# EasyEDA Pro project ProPrj_图书馆管理系统.epro

# Schematic Schematic1
Board Name: Board1; Create Date: 2025-07-24; Page Name: P1; Project Name: 图书馆管理系统; Schematic Name: Schematic1; Update Date: 2025-07-24; Company: 嘉立创EDA; Page Size: A4; Version: V1.0
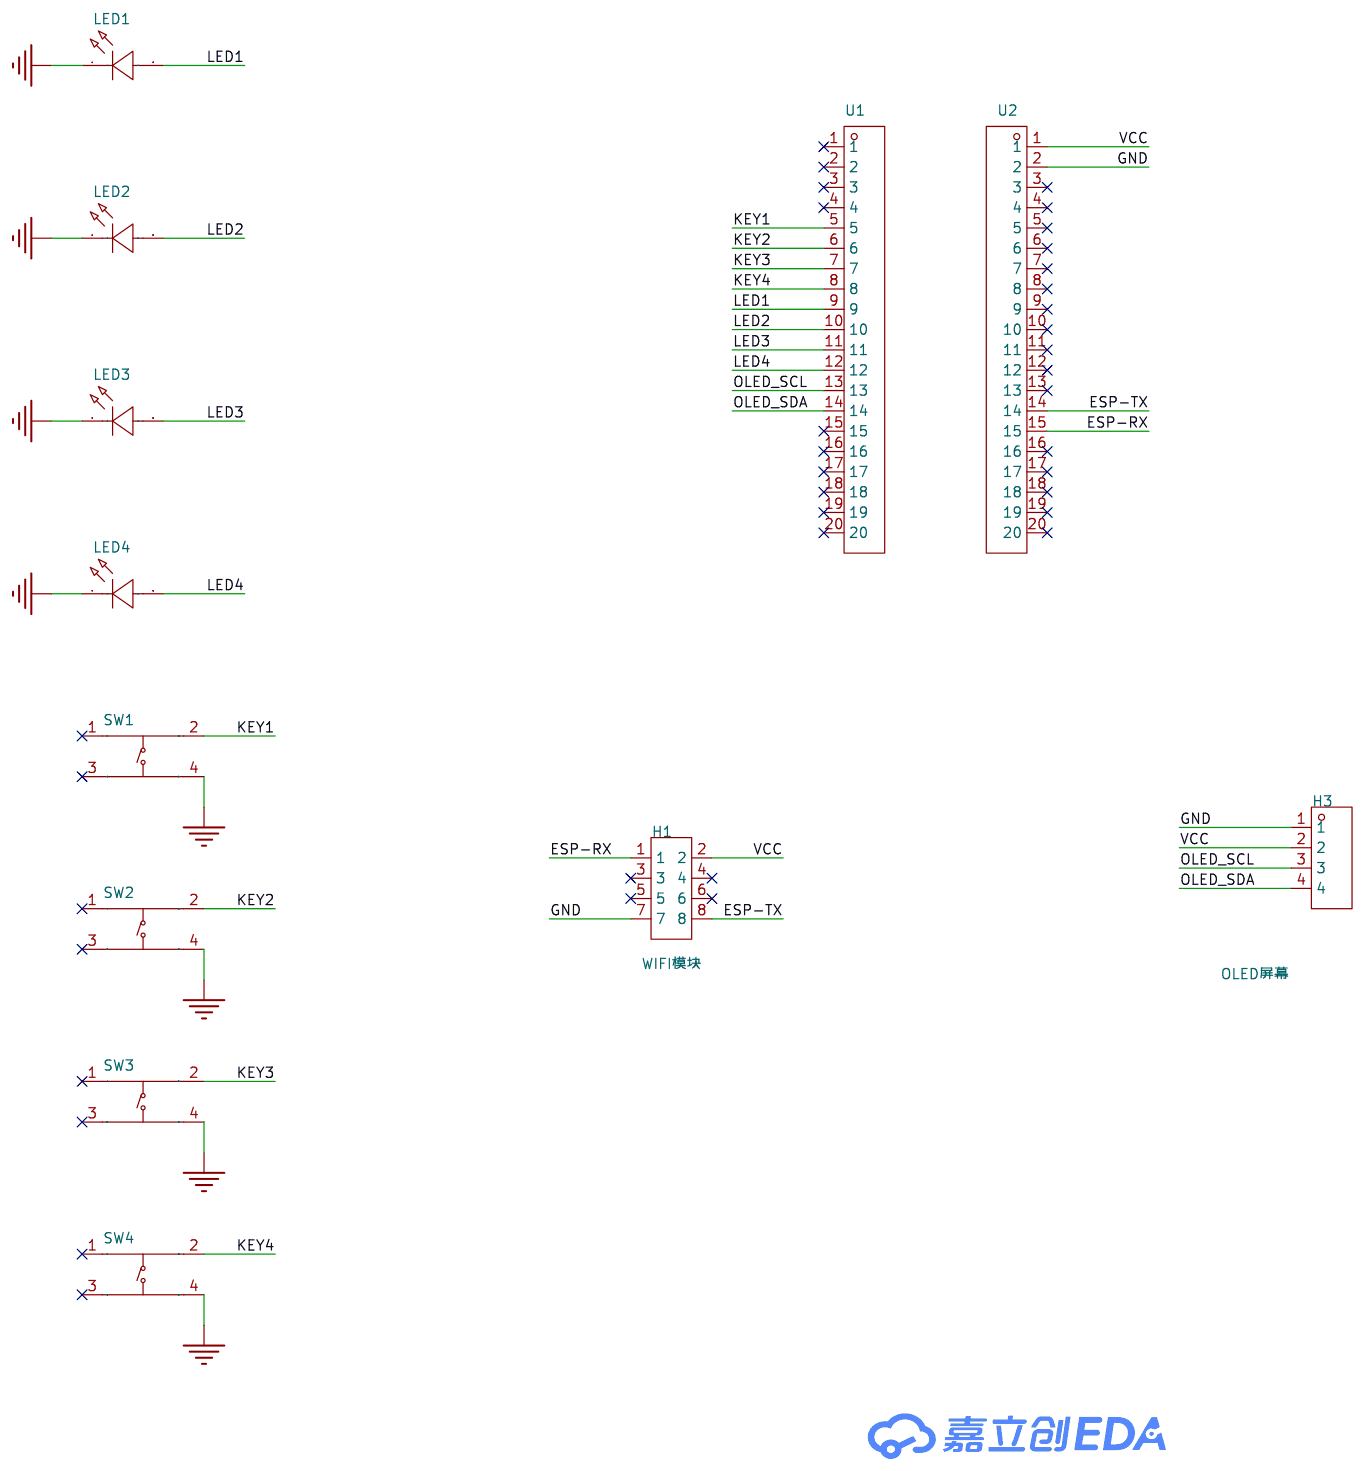
[diagram p0: schematic sheet]

## Parts
H1  WIFI模块  [HDR-TH_8P-P2.54-V-M-R2-C4-S2.54]
H3  OLED屏幕  [HDR-TH_4P-P2.54-V-M]
LED1  XL-302SURD  [LED-TH_BD3.8-P2.54-RD]
LED2  XL-302SURD  [LED-TH_BD3.8-P2.54-RD]
LED3  XL-302SURD  [LED-TH_BD3.8-P2.54-RD]
LED4  XL-302SURD  [LED-TH_BD3.8-P2.54-RD]
SW1  TS665CJ  [SW-TH_4P-L6.0-W6.0-P4.50-LS6.5]
SW2  TS665CJ  [SW-TH_4P-L6.0-W6.0-P4.50-LS6.5]
SW3  TS665CJ  [SW-TH_4P-L6.0-W6.0-P4.50-LS6.5]
SW4  TS665CJ  [SW-TH_4P-L6.0-W6.0-P4.50-LS6.5]
U1  ZX-PM2.54-1-20PY  [HDR-TH_20P-P2.54-V-F]
U2  ZX-PM2.54-1-20PY  [HDR-TH_20P-P2.54-V-F]

## Library data of the parts
H1 = PZ254V-12-8P: 插针结构:2x4P;间距:2.54mm;行距:2.54mm;圆针/方针:方针;安装方式:直插;排数:双排;总PIN位数:8P;额定电流:-;额定电压:-;配合针长度:6mm;塑高:2.5mm;端接针长度:3mm;触头材质:黄铜;触头镀层:-;工作温度:-40℃~+105℃;颜色:黑色;; LCSC Part Name: 2x4P 间距:2.54mm 方针 直插; Supplier Part: C492421; Manufacturer: XFCN(兴飞); Supplier Footprint: 插件,P=2.54mm; JLCPCB Part Class: 扩展库; Datasheet: https://atta.szlcsc.com/upload/public/pdf/source/20200309/C492421_DC8A206AF99CD7755BD4A5B0BC48200B.pdf; Supplier: LCSC; Pin Structure: 2x4P; Pitch: 2.54mm; Row Spacing: 2.54mm; Circluar Pins/Square Pins: 方针; Mounting Type: 直插; Number of Rows: 双排; Number of Pins: 8P; Length of Mating Pin: 6mm; Insulation Height: 2.5mm; Length of End Connection Pin: 3mm; Contact Material: 黄铜; Operating Temperature: -40℃~+105℃; Color: 黑色
H3 = PZ254V-11-04P: 插针结构:1x4P;间距:2.54mm;行距:-;圆针/方针:方针;安装类型:直插;排数:单排;总PIN位数:4P;额定电流:3A;额定电压:250V;配合针长度:6mm;塑高:2.5mm;端接针长度:3mm;触头材质:-;工作温度范围:-40℃~+105℃;颜色:黑色;; LCSC Part Name: 间距:2.54mm 1x4P 直插 方针; Supplier Part: C2691448; Manufacturer: XFCN(兴飞); Supplier Footprint: 插件,P=2.54mm; Datasheet: https://atta.szlcsc.com/upload/public/pdf/source/20200309/C492403_F9F19131791D08044AD4F84F8E751A34.pdf; Supplier: LCSC; Pin Structure: 1x4P; Pitch: 2.54mm; Circluar Pins/Square Pins: 方针; Mounting Type: 直插; Number of Rows: 单排; Number of Pins: 4P; Current Rating (Max): 3A; Voltage Rating (Max): 250V; Length of Mating Pin: 6mm; Insulation Height: 2.5mm; Length of End Connection Pin: 3mm; Operating Temperature Range: -40℃~+105℃; Color: 黑色
LED1-LED4 = XL-302SURD: 灯头类型:3mm圆形灯头;发光颜色:红色;功率:80mW;正向电流:30mA;主波长:615nm~620nm;透镜颜色:红色透镜;色温:-;发光角度:50°;载带方式:-;工作温度:-25℃~+85℃;; Supplier Part: C2895470; Manufacturer: XINGLIGHT(成兴光); Supplier Footprint: 插件,D=3mm; JLCPCB Part Class: 扩展库; Datasheet: https://atta.szlcsc.com/upload/public/pdf/source/20240112/E1E2B82945FD635E4907401DDE6D4922.pdf; Supplier: LCSC; Lamp Holder Type: 3mm圆形灯头; Emitted Color: 红色; Power Dissipation: 80mW; Forward Current: 30mA; Dominant Wavelength: 615nm~620nm; Peak Wavelength: 625nm; Lens Color: 红色透镜; Viewing Angle: 50°; Operating Temperature: -25℃~+85℃
SW1-SW4 = TS665CJ: 电路结构:单刀单掷;按钮形状:圆形按钮;安装方式:直插;开关长度:6mm;开关宽度:6mm;开关高度:5mm;触点电流:50mA;额定电压(DC):12V;带灯:-;机械寿命:-;; LCSC Part Name: 6*6*5mm 直插 轻触开关; Supplier Part: C393938; Manufacturer: SHOU HAN(首韩); Supplier Footprint: 插件; JLCPCB Part Class: 扩展库; Datasheet: https://atta.szlcsc.com/upload/public/pdf/source/20190521/C393938_BDABEAC600B4C55E200A80AA129B70BC.pdf; Supplier: LCSC; Circuit: 单刀单掷; Actuator Style: 圆形按钮; Mounting Style: 直插; Switch Length: 6mm; Switch Width: 6mm; Switch Height: 5mm; Contact Current: 50mA; Voltage Rating (DC): 12V
U1 U2 = ZX-PM2.54-1-20PY: 插孔结构:1x20P;间距:2.54mm;行距:-;圆孔/方孔:方孔;安装方式:直插;排数:单排;总孔位数:20P;额定电流:3A;额定电压:-;插孔方向:顶部;塑高:8.5mm;触头材质:-;触头镀层:金;工作温度:-40℃~+105℃;; LCSC Part Name: 1x20P 间距:2.54mm 直插; Supplier Part: C7499336; Manufacturer: Megastar(兆星); Supplier Footprint: 插件,P=2.54mm; JLCPCB Part Class: 扩展库; Datasheet: https://atta.szlcsc.com/upload/public/pdf/source/20231122/D07E8E83FD020EE141D56DDF9758AF41.pdf; Supplier: LCSC; Holes Structure: 1x20P; Pitch: 2.54mm; Circular Hole / Square Hole: 方孔; Mounting Type: 直插; Number of Rows: 单排; Number of Positions: 20P; Current Rating: 3A; Holes Direction: 顶部; Insulation Height: 8.5mm; Contact Plating: 金; Operating Temperature: -40℃~+105℃; PIN Length: 3.2mm

## Nets
GND: H1.7 H3.1 LED1.1(K) LED2.1(K) LED3.1(K) LED4.1(K) SW1.4(D) SW2.4(D) SW3.4(D) SW4.4(D) U2.2
VCC: H1.2 H3.2 U2.1
ESP-RX: H1.1 U2.15
ESP-TX: H1.8 U2.14
KEY1: SW1.2(B) U1.5
KEY2: SW2.2(B) U1.6
KEY3: SW3.2(B) U1.7
KEY4: SW4.2(B) U1.8
LED1: LED1.2(A) U1.9
LED2: LED2.2(A) U1.10
LED3: LED3.2(A) U1.11
LED4: LED4.2(A) U1.12
OLED_SCL: H3.3 U1.13
OLED_SDA: H3.4 U1.14

Not connected (* = marked no-connect by the designer): H1 3* 4* 5* 6*; SW1 1(A)* 3(C)*; SW2 1(A)* 3(C)*; SW3 1(A)* 3(C)*; SW4 1(A)* 3(C)*; U1 1* 2* 3* 4* 15* 16* 17* 18* 19* 20*; U2 3* 4* 5* 6* 7* 8* 9* 10* 11* 12* 13* 16* 17* 18* 19* 20*

# Board PCB1
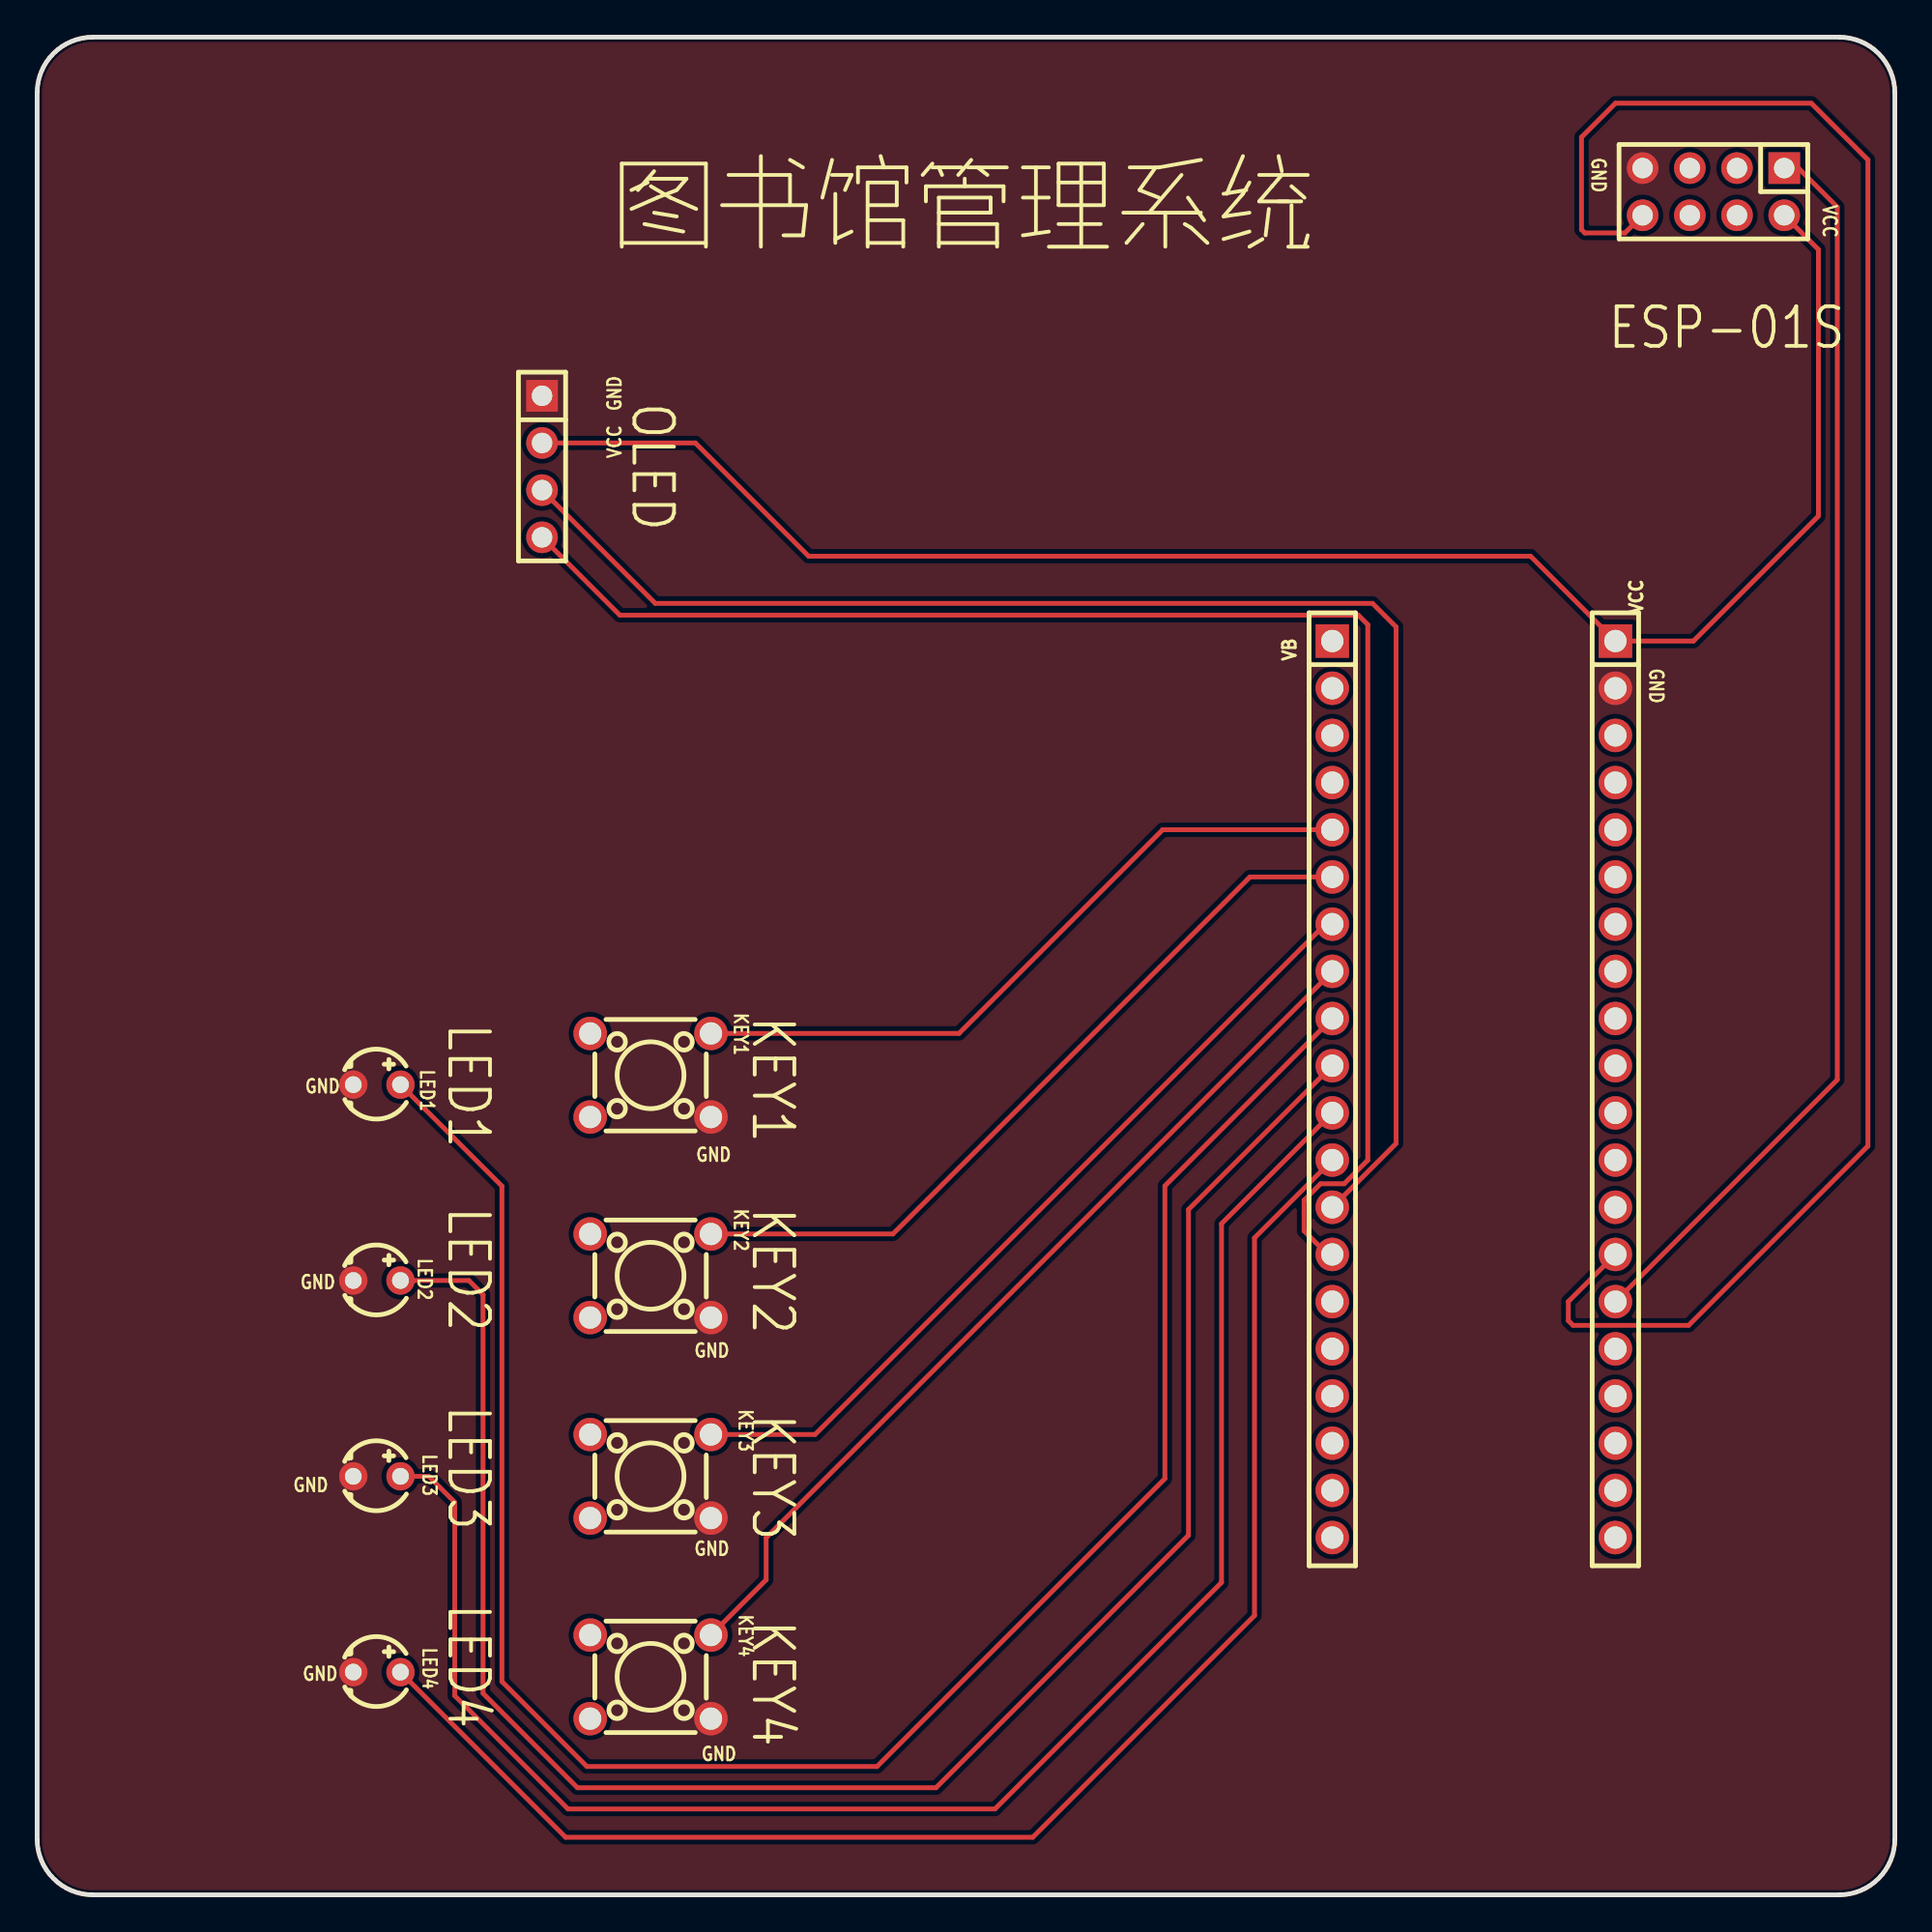
[diagram p1: board, top side]
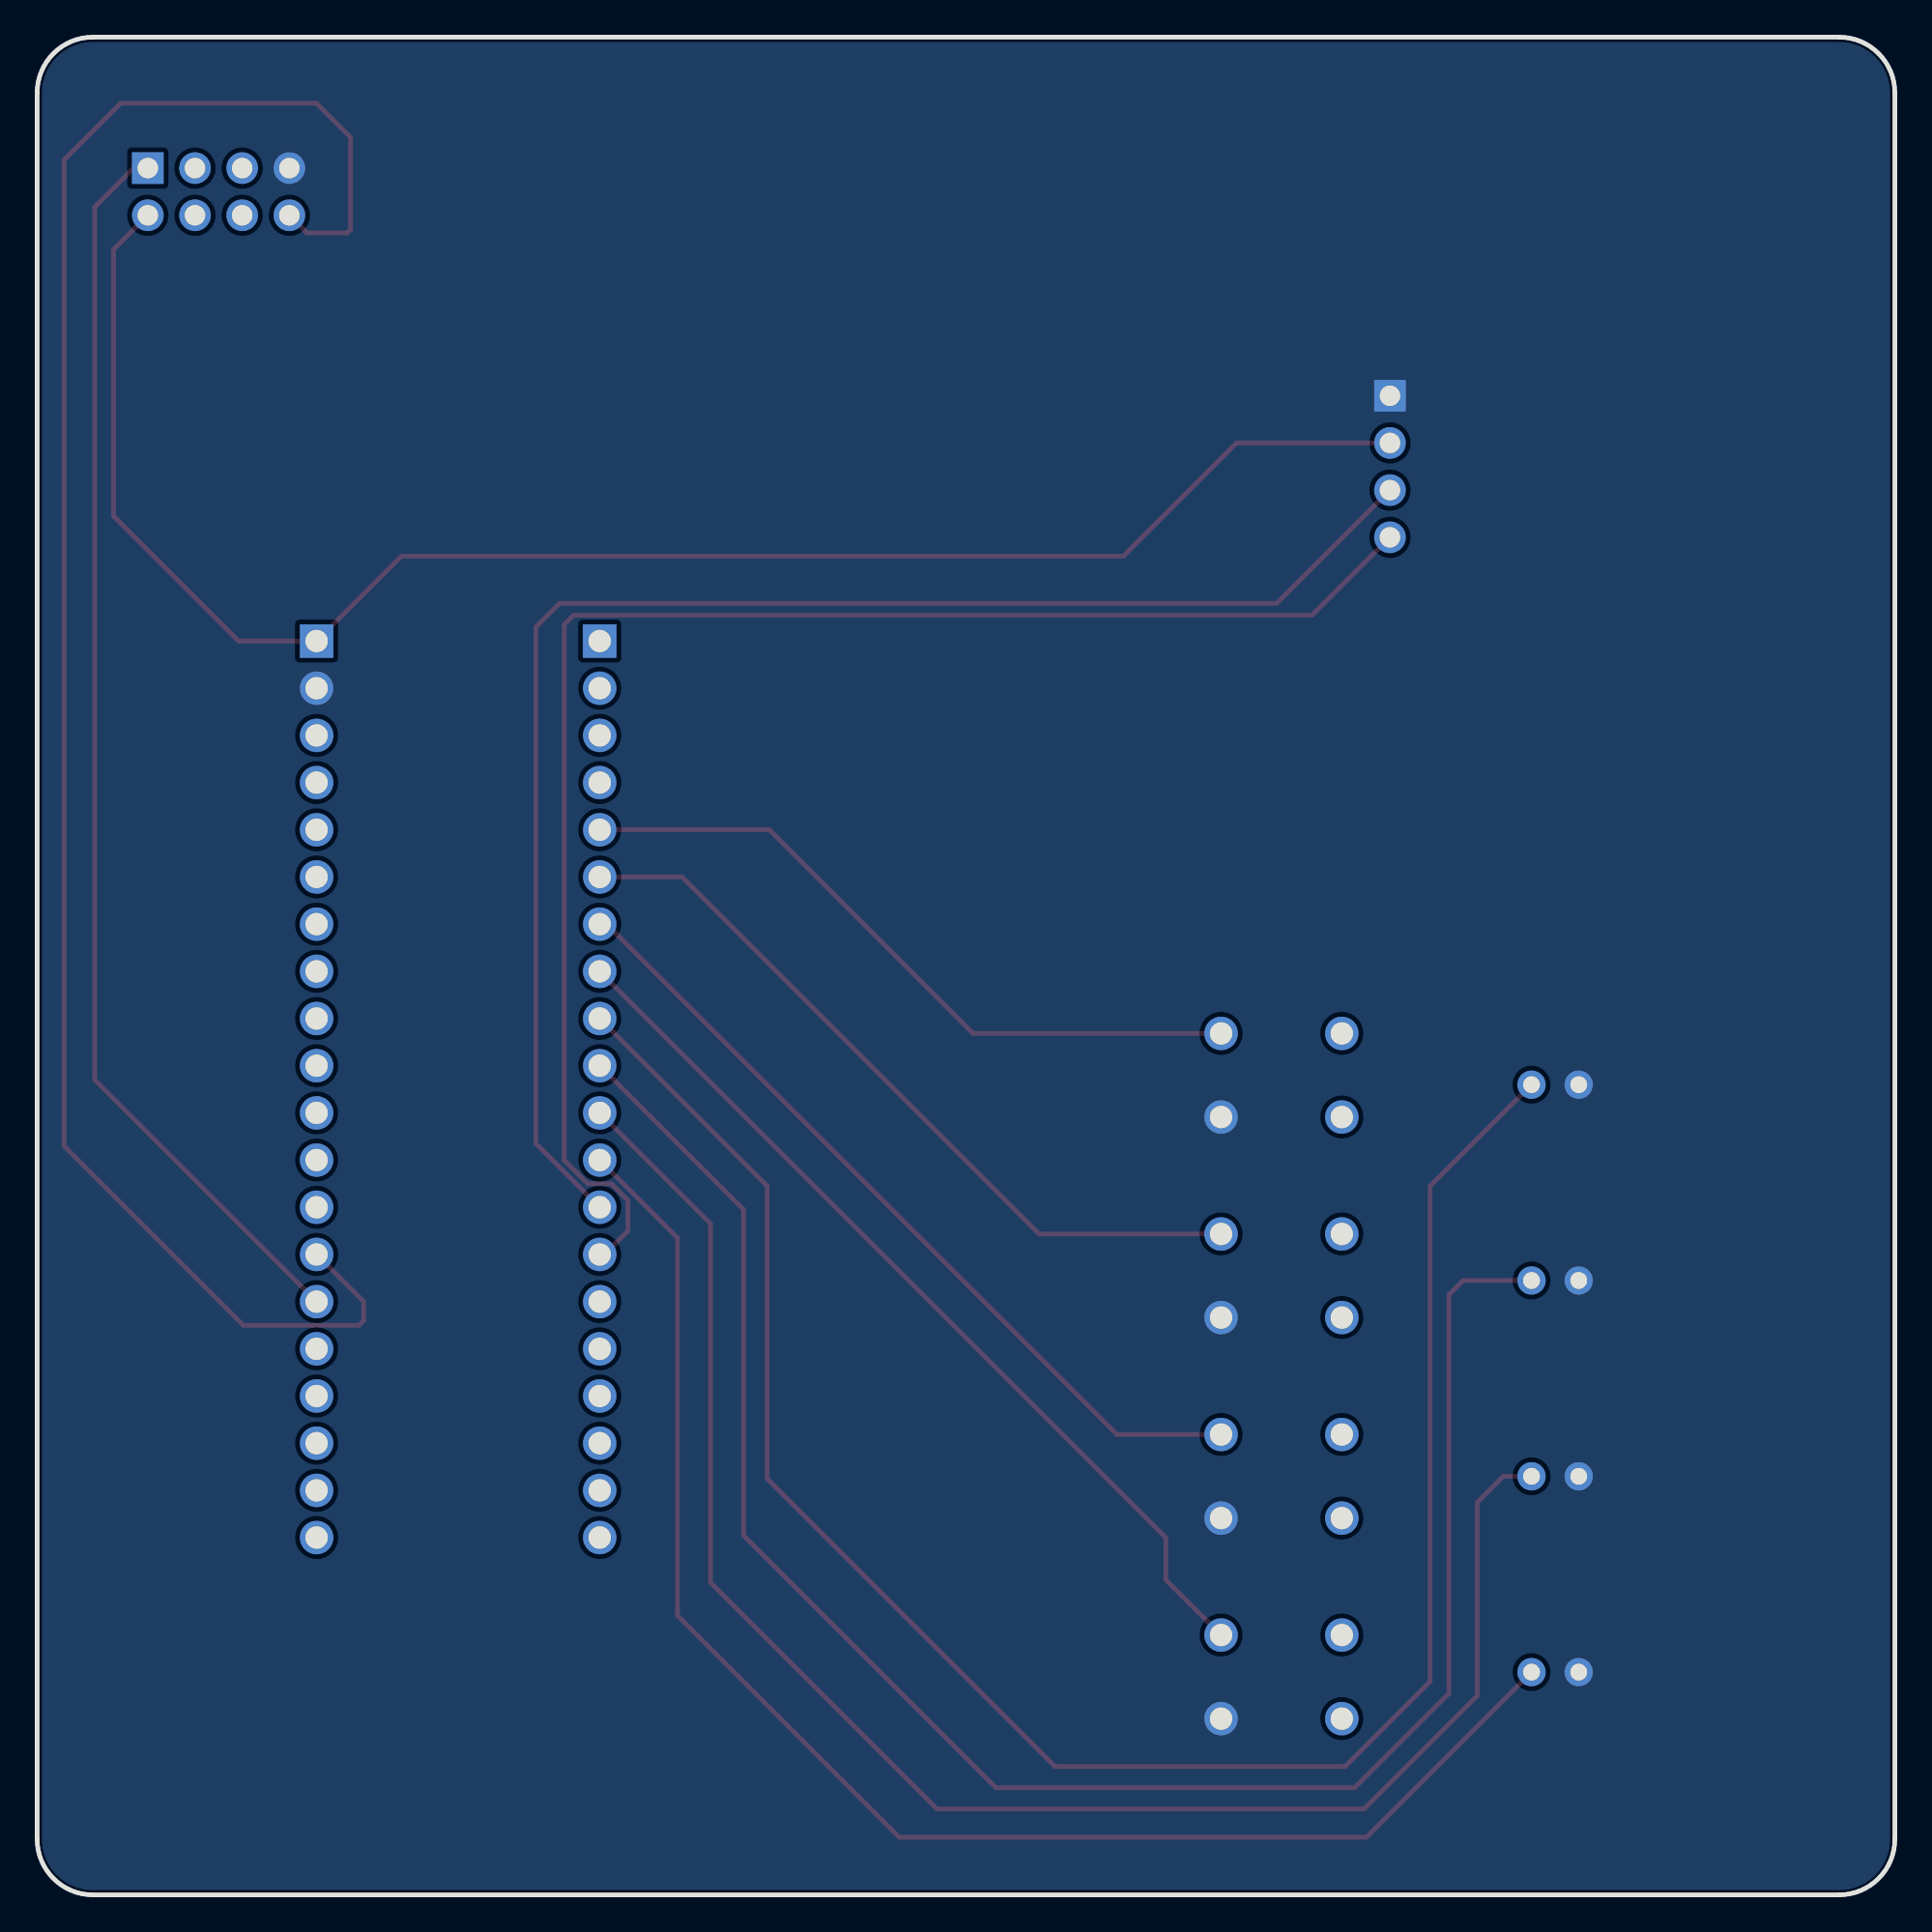
[diagram p2: board, bottom side, seen from below]

Outline 100 x 100 mm; copper layers: Top Layer, Bottom Layer. Coordinates in mm from the lower left corner of the outline.
Outline path: 0,97 0,3 arc(0.88,0.88) 3,0 97,0 arc(99.12,0.88) 100,3 100,97 arc(99.12,99.12) 97,100 3,100 arc(0.88,99.12) 0,97
Stack: Top Layer 0.035mm / Dielectric1 1.51mm FR4 er 4.5 / Bottom Layer 0.035mm

## Design rules (mm)
template: 自定义配置
spacing copperThickness1oz (default): track to track 0.102, other pairs 0.152 to 0.3
spacing copperThickness2oz: track to track 0.203, other pairs 0.152 to 0.3
track width copperThickness1oz (default): min 0.127, default 0.254, max 2.54
track width copperThickness2oz: min 0.203, default 0.254, max 2.54
differential pair differentialPair (default): width min 0.127, default 0.254, max 2.54; gap min 0.152, default 0.152
via viaSize (default): diameter min 0.5, default 0.61, max 10; hole min 0.3, default 0.305, max 6.3

## Placement (name value [footprint] x y rotation side)
H1  WIFI模块  [HDR-TH_8P-P2.54-V-M-R2-C4-S2.54]  90.23 91.68 180 top
H3  OLED屏幕  [HDR-TH_4P-P2.54-V-M]  27.18 76.89 270 top
LED1  XL-302SURD  [LED-TH_BD3.8-P2.54-RD]  18.29 43.61 0 top
LED2  XL-302SURD  [LED-TH_BD3.8-P2.54-RD]  18.29 33.07 0 top
LED3  XL-302SURD  [LED-TH_BD3.8-P2.54-RD]  18.29 22.53 0 top
LED4  XL-302SURD  [LED-TH_BD3.8-P2.54-RD]  18.29 11.99 0 top
SW1  TS665CJ  [SW-TH_4P-L6.0-W6.0-P4.50-LS6.5]  33.02 44.12 0 top
SW2  TS665CJ  [SW-TH_4P-L6.0-W6.0-P4.50-LS6.5]  33.02 33.33 0 top
SW3  TS665CJ  [SW-TH_4P-L6.0-W6.0-P4.50-LS6.5]  33.02 22.53 0 top
SW4  TS665CJ  [SW-TH_4P-L6.0-W6.0-P4.50-LS6.5]  33.02 11.74 0 top
VB  ZX-PM2.54-1-20PY  [HDR-TH_20P-P2.54-V-F]  69.72 43.36 270 top
VCC  ZX-PM2.54-1-20PY  [HDR-TH_20P-P2.54-V-F]  84.96 43.36 270 top

## Footprints (pads in the part's own frame, mm; a bottom-side part is the same pattern mirrored in y, then rotated)
HDR-TH_4P-P2.54-V-M
  rect 1.7x1.7 hole 1.1: 1(-3.81,0)
  round 1.7 hole 1.1: 2(-1.27,0) 3(1.27,0) 4(3.81,0)
HDR-TH_8P-P2.54-V-M-R2-C4-S2.54
  rect 1.7x1.7 hole 1.1: 1(-3.81,-1.27)
  round 1.7 hole 1.1: 2(-3.81,1.27) 3(-1.27,-1.27) 4(-1.27,1.27) 5(1.27,-1.27) 6(1.27,1.27) 7(3.81,-1.27) 8(3.81,1.27)
HDR-TH_20P-P2.54-V-F
  rect 1.8x1.8 hole 1.2: 1(-24.13,0)
  round 1.8 hole 1.2: 2(-21.59,0) 3(-19.05,0) 4(-16.51,0) 5(-13.97,0) 6(-11.43,0) 7(-8.89,0) 8(-6.35,0) 9(-3.81,0) 10(-1.27,0) 11(1.27,0) 12(3.81,0) 13(6.35,0) 14(8.89,0) 15(11.43,0) 16(13.97,0) 17(16.51,0) 18(19.05,0) 19(21.59,0) 20(24.13,0)
LED-TH_BD3.8-P2.54-RD
  round 1.524 hole 0.9: 1(-1.27,0) 2(1.27,0)
SW-TH_4P-L6.0-W6.0-P4.50-LS6.5
  round 1.8 hole 1.2: 1(-3.25,2.25) 2(3.25,2.25) 3(-3.25,-2.25) 4(3.25,-2.25)

## Nets
GND: H1.7 H3.1 LED1.1 LED2.1 LED3.1 LED4.1 SW1.4 SW2.4 SW3.4 SW4.4 VCC.2
VCC: H1.2 H3.2 VCC.1
ESP-RX: H1.1 VCC.15
ESP-TX: H1.8 VCC.14
KEY1: SW1.2 VB.5
KEY2: SW2.2 VB.6
KEY3: SW3.2 VB.7
KEY4: SW4.2 VB.8
LED1: LED1.2 VB.9
LED2: LED2.2 VB.10
LED3: LED3.2 VB.11
LED4: LED4.2 VB.12
OLED_SCL: H3.3 VB.13
OLED_SDA: H3.4 VB.14

Pads without a net: H1 3 4 5 6; SW1 1 3; SW2 1 3; SW3 1 3; SW4 1 3; VB 1 2 3 4 15 16 17 18 19 20; VCC 3 4 5 6 7 8 9 10 11 12 13 16 17 18 19 20

## Routing (per net, layer and track width the routed paths; a pad name or vN(x,y) marks a point on that pad's centre or on a via; arc(x,y) is an arc through that point)
VCC: length 92.9
  Top Layer w0.254: H1.2 95.89,88.57 95.89,74.22 89.16,67.49 VCC.1 80.39,72.06 41.53,72.06 35.43,78.16 H3.2
ESP-RX: length 67.6
  Top Layer w0.254: VCC.15 96.9,43.88 96.9,90.86 94.81,92.95 H1.1
ESP-TX: length 104.1
  Top Layer w0.254: H1.8 85.47,89.46 83.31,89.46 83.13,89.64 83.13,94.61 84.96,96.44 95.5,96.44 98.55,93.4 98.55,40.31 88.9,30.66 82.68,30.66 82.42,30.91 82.42,31.94 VCC.14
KEY1: length 38
  Top Layer w0.254: VB.5 60.58,57.33 49.62,46.37 SW1.2
KEY2: length 41.4
  Top Layer w0.254: SW2.2 46.07,35.58 65.28,54.79 VB.6
KEY3: length 44.8
  Top Layer w0.254: VB.7 69.35,52.25 41.87,24.78 SW3.2
KEY4: length 49.6
  Top Layer w0.254: SW4.2 39.24,16.96 39.24,19.23 69.72,49.7 VB.8
LED1: length 106.9
  Top Layer w0.254: VB.9 60.71,38.16 60.71,22.4 45.21,6.91 29.59,6.91 25.02,11.48 25.02,38.15 LED1.2
LED2: length 100.4
  Top Layer w0.254: VB.10 61.98,36.89 61.98,19.36 48.39,5.77 29.08,5.77 24,10.85 24,32.31 23.24,33.07 LED2.2
LED3: length 90.5
  Top Layer w0.254: LED3.2 21.08,22.53 22.48,21.13 22.48,10.72 28.58,4.62 51.56,4.62 63.75,16.81 63.75,36.13 VB.11
LED4: length 80.9
  Top Layer w0.254: LED4.2 28.45,3.1 53.59,3.1 65.53,15.04 65.53,35.37 VB.12
OLED_SCL: length 81.7
  Top Layer w0.254: H3.3 33.27,69.52 71.88,69.52 73.15,68.25 73.15,40.45 VB.13
OLED_SDA: length 83.2
  Top Layer w0.254: VB.14 69.46,34.47 68.2,35.74 68.2,37.39 69.09,38.28 70.36,38.28 71.63,39.55 71.63,68.38 71.12,68.89 31.37,68.89 H3.4

## Copper pours and planes (outline as drawn; the poured copper is in the pictures)
GND on Top Layer: -13.59,112.19 112.27,112.19 112.27,-7.7 -13.59,-7.7
GND on Bottom Layer: -15.49,111.56 110.24,111.56 110.24,-6.55 -15.49,-6.55

## Text on the board
Top Silkscreen Layer: GND | VCC | LED2 | LED1 | LED3 | KEY1 | KEY2 | KEY3 | KEY4 | LED4 | OLED | ESP-01S | 图书馆管理系统
